# EAGLE design servo (EAGLE 8.1.0)
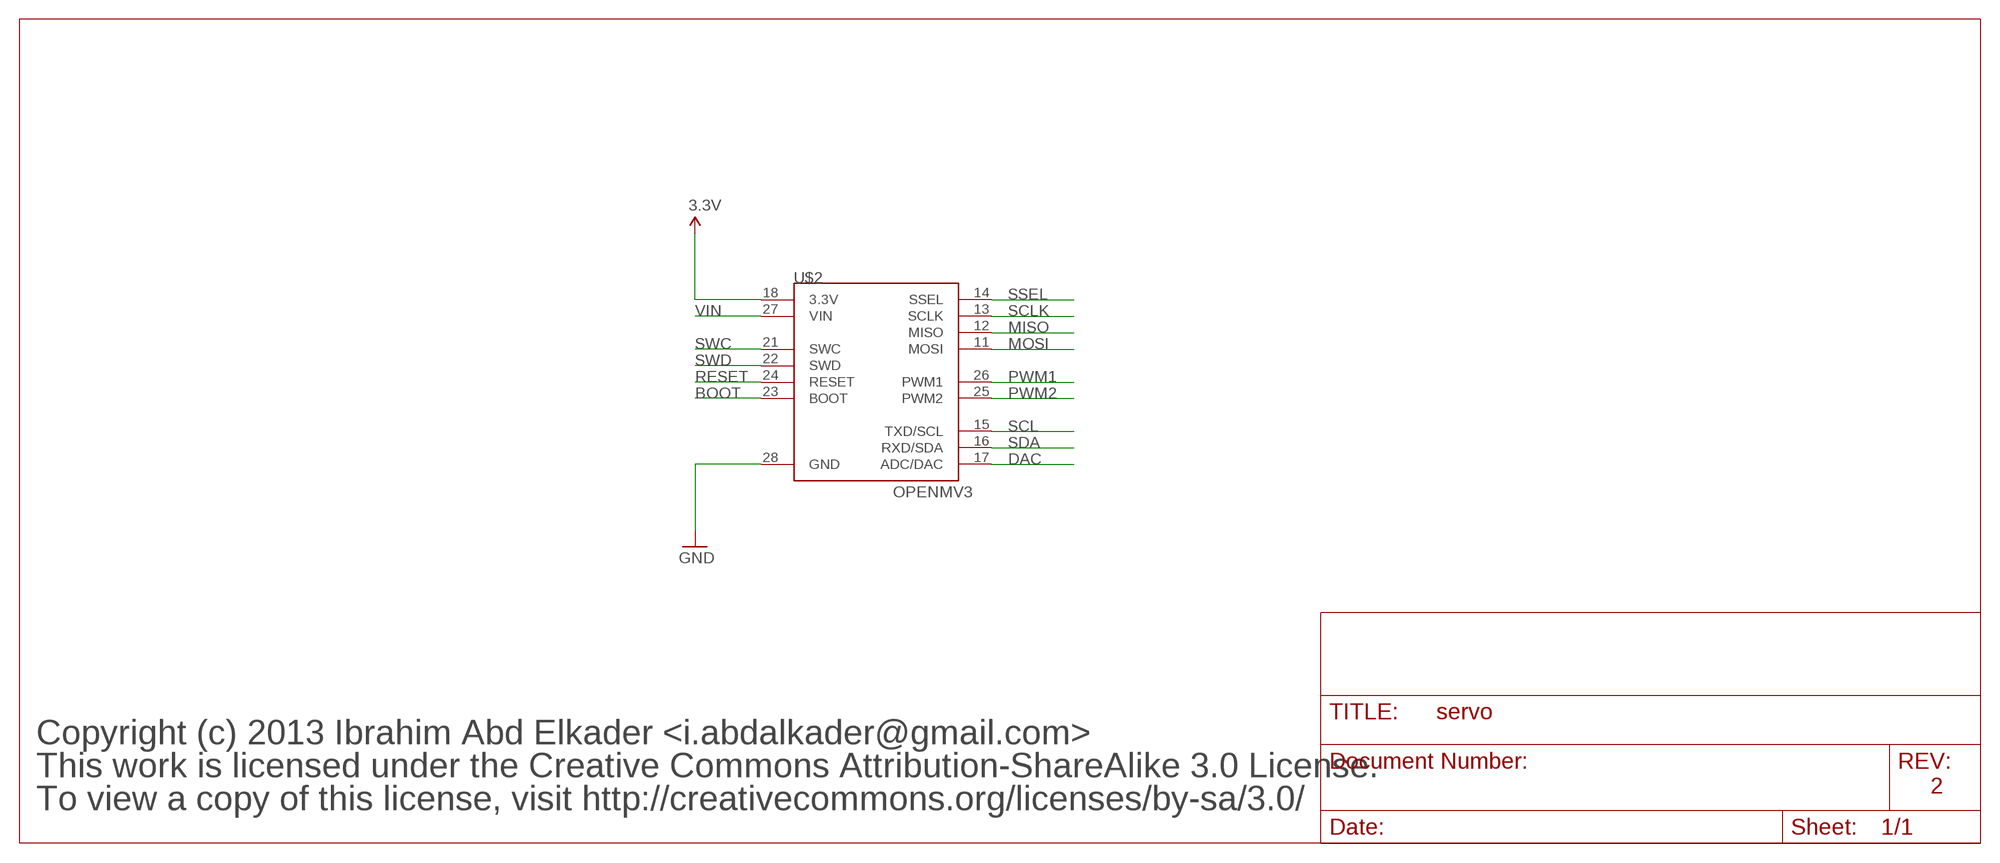
[diagram p0: schematic, sheet 1]

## Parts
U$2  OPENMV3  [OPENMV3]

## Nets
3.3V: U$2.18(3.3V)
BOOT: U$2.23(BOOT)
DAC: U$2.17(ADC/DAC)
GND: U$2.28(GND)
MISO: U$2.12(MISO)
MOSI: U$2.11(MOSI)
PWM1: U$2.26(PWM1)
PWM2: U$2.25(PWM2)
RESET: U$2.24(RESET)
SCL: U$2.15(TXD/SCL)
SCLK: U$2.13(SCLK)
SDA: U$2.16(RXD/SDA)
SSEL: U$2.14(SSEL)
SWC: U$2.21(SWC)
SWD: U$2.22(SWD)
VIN: U$2.27(VIN)

## Notes on the sheet
- Copyright (c) 2013 Ibrahim Abd Elkader <i.abdalkader@gmail.com>
- This work is licensed under the Creative Commons Attribution-ShareAlike 3.0 License.
- 2
- To view a copy of this license, visit http://creativecommons.org/licenses/by-sa/3.0/

## Library data of the parts
U$2 = openmv:OPENMV3

## Net classes
1 vcc: width 1.016 mm, clearance 0.203 mm
2 antenna: width 0.363 mm, clearance 0.305 mm
3 1.8v: width 0.457 mm, clearance 0.254 mm

## Board
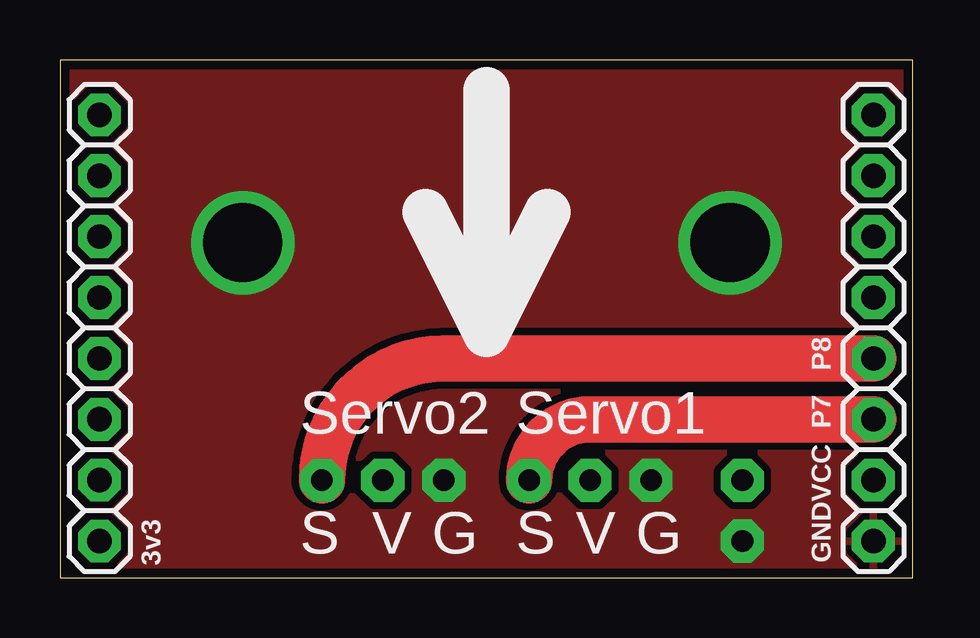
[diagram p1: board, top side]
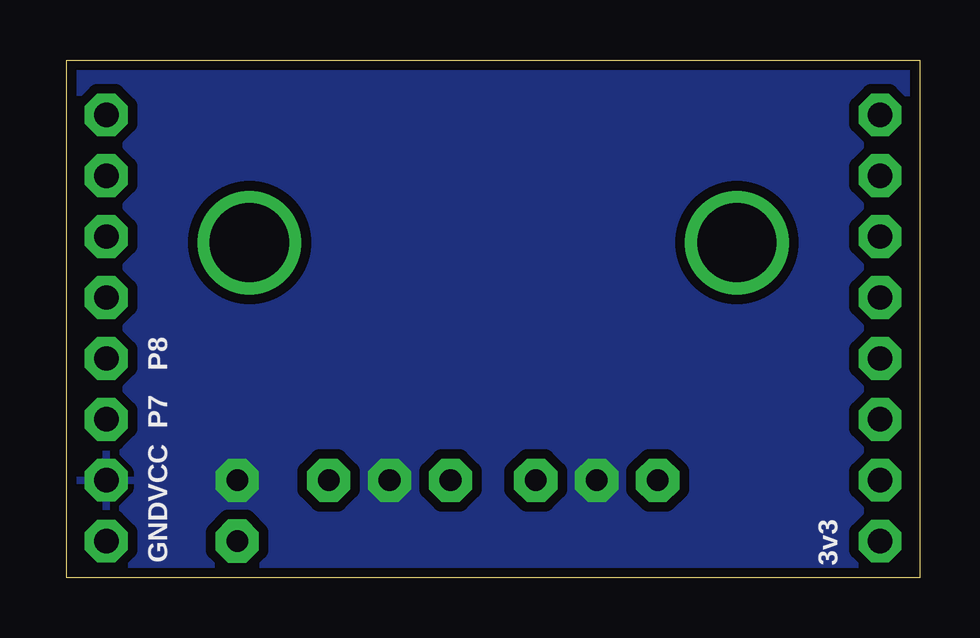
[diagram p2: board, bottom side, seen from below]

Size 35.56 x 21.59 mm. Coordinates in mm from the lower left corner, seen from the top.
Outline: 0,0 35.56,0 35.56,21.59 0,21.59 0,0
Copper layers (1*16): Top 0.0356mm / dielectric 1.5011mm / Bottom 0.0356mm
Design rules "default": minimum track width 6mil, minimum drill 13mil, track to track 6mil, track to pad 6mil, pad to pad 6mil, via to via 6mil, smd to smd 6mil, copper to edge 15mil, drill to drill 6mil, minimum pad ring 7mil, minimum via ring 7mil, stop-mask expansion 3mil, vias tented up to drill 30mil, thermal gap 10mil

### Footprints (pad centres in the part's own frame; a part is rotated, then mirrored left to right if it is on the bottom)
OPENMV3 = drill 1.016 pad 1.778 octagon: 11 1.651,19.304; 12 1.651,16.764; 13 1.651,14.224; 14 1.651,11.684; 15 1.651,9.144; 16 1.651,6.604; 17 1.651,4.064; 18 1.651,1.524; 21 33.909,19.304; 22 33.909,16.764; 23 33.909,14.224; 24 33.909,11.684; 25 33.909,9.144; 26 33.909,6.604; 27 33.909,4.064; 28 33.909,1.524

### Placement (x,y rotation side)
U$2  0,0 0 top

### Tracks (layer width: path | path; a pad name or v marks a point on that pad's centre or on a via)
GND  (via drill 0.9, 3.3)
  other vias: 24.64,4.06 16,4.06 28.45,1.52 7.62,13.97 27.94,13.97
  pour Top (isolate 0.305, rank 2): 0,0 35.56,0 35.56,21.59 0,21.59
PWM1  (via drill 0.9)
  Top 1.93: U$2.26 22.1,6.6 arc90 v19.56,4.06
PWM2  (via drill 0.9)
  Top 1.93: U$2.25 16,9.14 arc90 v10.92,4.06
VIN  (via drill 0.9)
  other vias: 22.1,4.06 13.46,4.06 28.45,4.06
  pour Bottom (isolate 0.406, rank 2): 0,0 35.56,0 35.56,21.59 0,21.59

### Text on the board
tPlace: OpenMV | Pan&Tilt | P8 | Servo2 | Servo1 | P7 | VCC | 3v3 | S | V | G | S | V | G | GND
bPlace: P8 | P7 | VCC | 3v3 | GND